# Altium schematic sheet FPGA_PWR.SchDoc: TE0722
size A4; Organization: Trenz Electronic GmbH; DocumentNumber: 6; Revision: 01; SheetNumber: 6; SheetTotal: 8; Date: 07.11.2014; PageSetup: Record=PageOptions|CenterHorizontal=True|CenterVertical=True|PrintScale=0.96|XCorrection=1.00|YCorrection=1.00|PrintKind=0|BorderSize=5000000|LeftOffset=0|BottomOffset=0|Orientation=2|PaperLength=1000|PaperWidth=1000|Scale=100|PaperSource=7|PrintQuality=-4|MediaType=1|DitherType=10|PaperKind=A4|PrintScaleMode=1
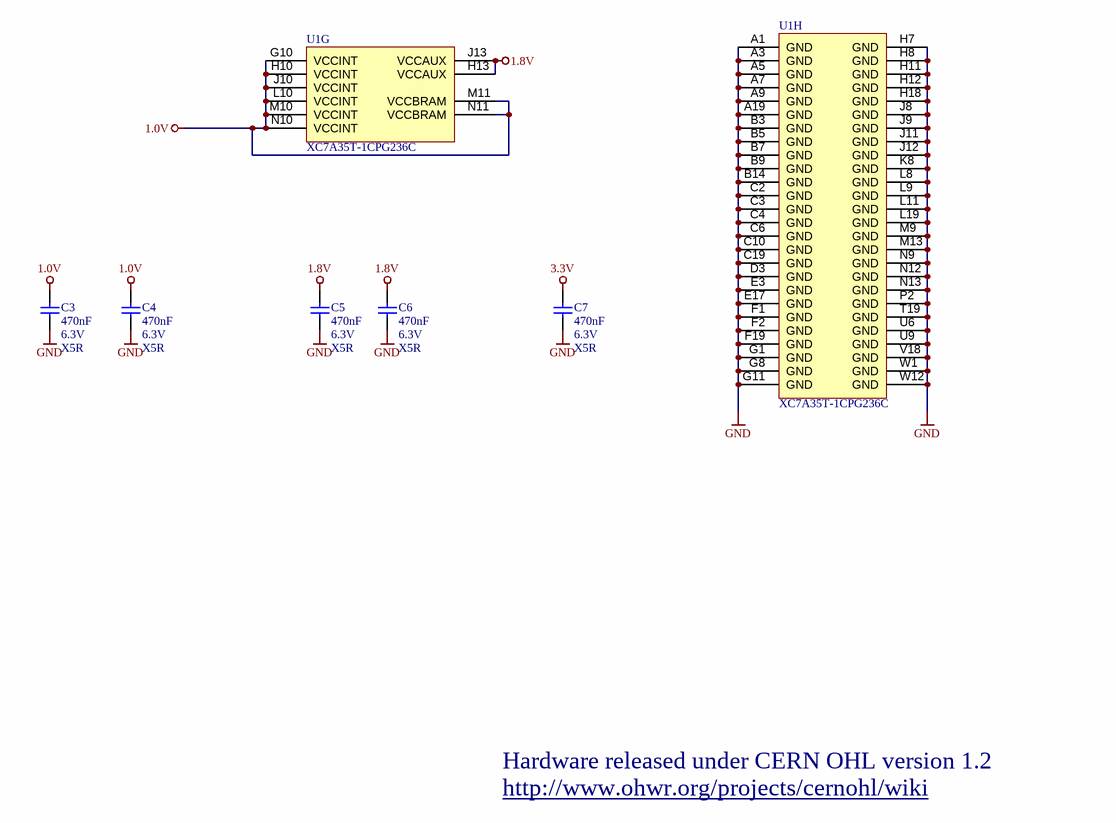
[diagram p0: FPGA_PWR.SchDoc]

## Parts
C3  470nF  Voltage: 6.3V  Technology: X5R  [CAPC0603X33N]
C4  470nF  Voltage: 6.3V  Technology: X5R  [CAPC0603X33N]
C5  470nF  Voltage: 6.3V  Technology: X5R  [CAPC0603X33N]
C6  470nF  Voltage: 6.3V  Technology: X5R  [CAPC0603X33N]
C7  470nF  Voltage: 6.3V  Technology: X5R  [CAPC0603X33N]
U1  XC7A35T-1CPG236C  [XC7AxxT-CPG236]  (parts G,H of 8)

## Nets
1.0V: C3.1 C4.1 U1.G10(VCCINT) U1.H10(VCCINT) U1.J10(VCCINT) U1.L10(VCCINT) U1.M10(VCCINT) U1.M11(VCCBRAM) U1.N10(VCCINT) U1.N11(VCCBRAM)
1.8V: C5.1 C6.1 U1.H13(VCCAUX) U1.J13(VCCAUX)
3.3V: C7.1
GND: C3.2 C4.2 C5.2 C6.2 C7.2 U1.A1(GND) U1.A3(GND) U1.A5(GND) U1.A7(GND) U1.A9(GND) U1.A19(GND) U1.B3(GND) U1.B5(GND) U1.B7(GND) U1.B9(GND) U1.B14(GND) U1.C2(GND) U1.C3(GND) U1.C4(GND) U1.C6(GND) U1.C10(GND) U1.C19(GND) U1.D3(GND) U1.E3(GND) U1.E17(GND) U1.F1(GND) U1.F2(GND) U1.F19(GND) U1.G1(GND) U1.G8(GND) U1.G11(GND) U1.H7(GND) U1.H8(GND) U1.H11(GND) U1.H12(GND) U1.H18(GND) U1.J8(GND) U1.J9(GND) U1.J11(GND) U1.J12(GND) U1.K8(GND) U1.L8(GND) U1.L9(GND) U1.L11(GND) U1.L19(GND) U1.M9(GND) U1.M13(GND) U1.N9(GND) U1.N12(GND) U1.N13(GND) U1.P2(GND) U1.T19(GND) U1.U6(GND) U1.U9(GND) U1.V18(GND) U1.W1(GND) U1.W12(GND)

## Notes on the sheet
- Hardware released under CERN OHL version 1.2
- http://www.ohwr.org/projects/cernohl/wiki
- Title:
- Nummer:
- Rev.
- Datum:
- A4
- Zeichner:
- Blatt
- von
- Filename:

## Library data of the parts
C3-C7 = 24921: KON 470nF X5R 6.3V SMD 20%; AN: 24921; Mixed: SMT; Value: 470n; Preferred: Yes; Case: 0603 (0201); Tolerance: 20%
U1 = 26752: AN: 26752; Mixed: SMT; Trenz-Stock: Yes; Case: CPG236; HelpURL: B:\ad\adlib\datasheet\XC7